# Altium schematic sheet 18-Led7.SchDoc
size A4
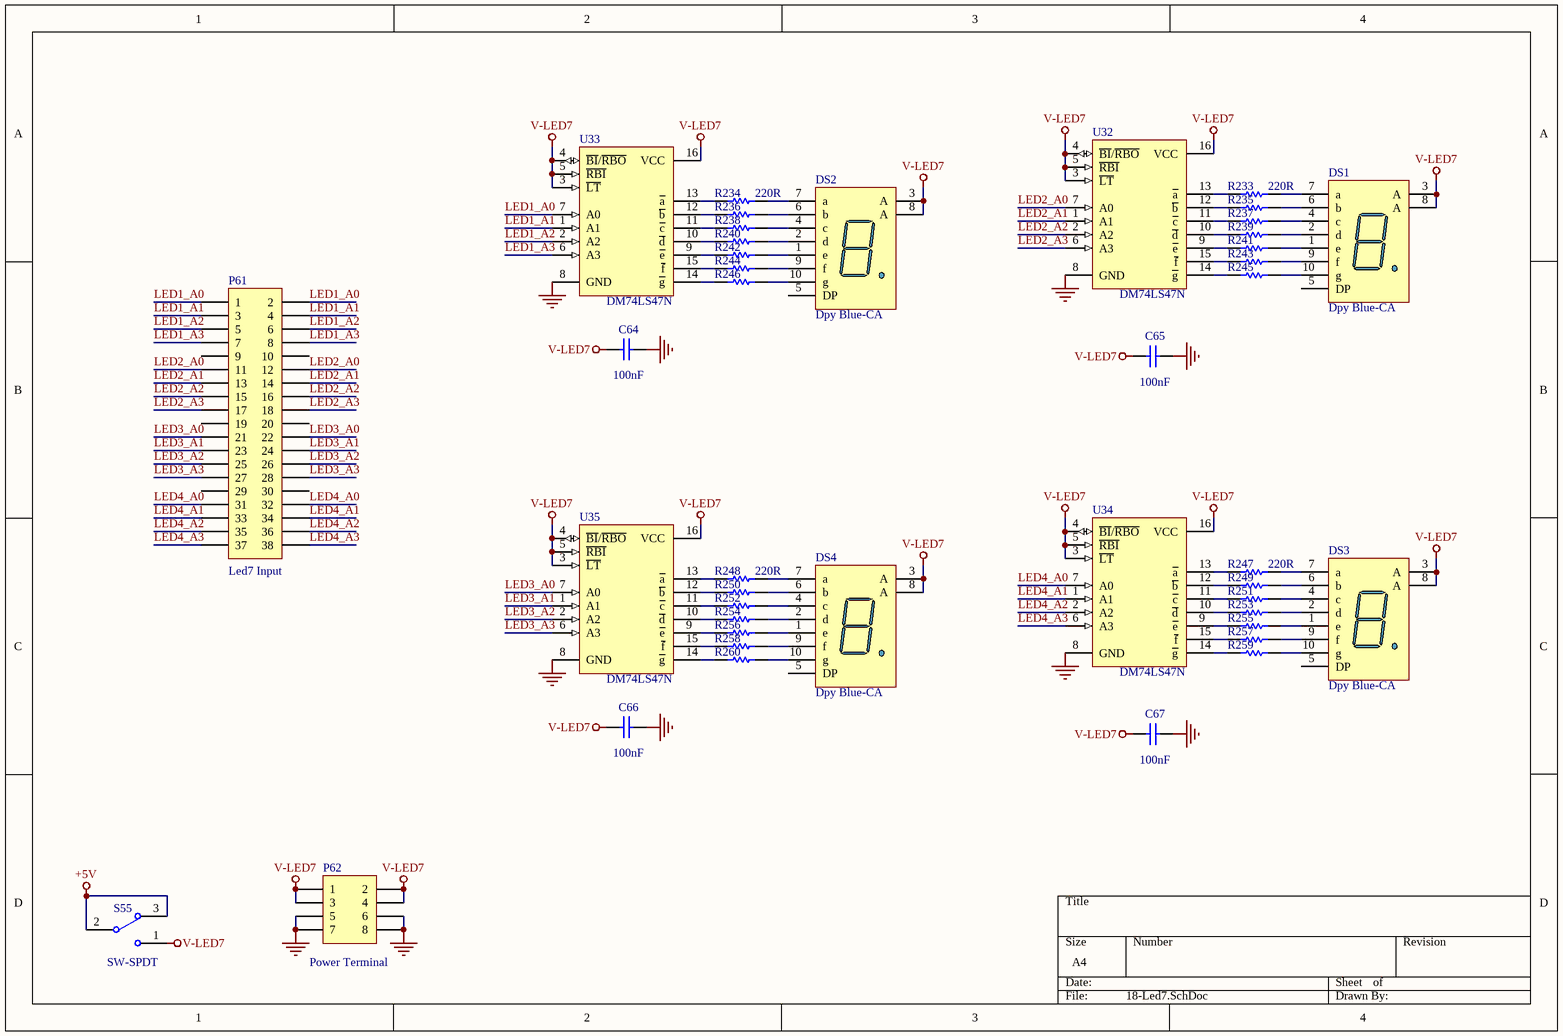
[diagram p0: 18-Led7.SchDoc]

## Parts
C64  value 100nF  [c-0805]  (hidden comment: 104)
C65  value 100nF  [c-0805]  (hidden comment: 104)
C66  value 100nF  [c-0805]  (hidden comment: 104)
C67  value 100nF  [c-0805]  (hidden comment: 104)
DS1  Dpy Blue-CA  [LED7SEG-1-0.56]
DS2  Dpy Blue-CA  [LED7SEG-1-0.56]
DS3  Dpy Blue-CA  [LED7SEG-1-0.56]
DS4  Dpy Blue-CA  [LED7SEG-1-0.56]
P61  value Led7 Input  [HDR2X19]  (hidden comment: Header 19X2)
P62  Publisher: Power Terminal  [HDR2X4]  (hidden comment: Header 4X2)
R233  220R  [r-0805]
R234  220R  [r-0805]
R235  220R  [r-0805]  (value not drawn)
R236  220R  [r-0805]  (value not drawn)
R237  220R  [r-0805]  (value not drawn)
R238  220R  [r-0805]  (value not drawn)
R239  220R  [r-0805]  (value not drawn)
R240  220R  [r-0805]  (value not drawn)
R241  220R  [r-0805]  (value not drawn)
R242  220R  [r-0805]  (value not drawn)
R243  220R  [r-0805]  (value not drawn)
R244  220R  [r-0805]  (value not drawn)
R245  220R  [r-0805]  (value not drawn)
R246  220R  [r-0805]  (value not drawn)
R247  220R  [r-0805]
R248  220R  [r-0805]
R249  220R  [r-0805]  (value not drawn)
R250  220R  [r-0805]  (value not drawn)
R251  220R  [r-0805]  (value not drawn)
R252  220R  [r-0805]  (value not drawn)
R253  220R  [r-0805]  (value not drawn)
R254  220R  [r-0805]  (value not drawn)
R255  220R  [r-0805]  (value not drawn)
R256  220R  [r-0805]  (value not drawn)
R257  220R  [r-0805]  (value not drawn)
R258  220R  [r-0805]  (value not drawn)
R259  220R  [r-0805]  (value not drawn)
R260  220R  [r-0805]  (value not drawn)
S55  SW-SPDT  [sW-DIP1SMD]
U32  DM74LS47N  [DIP16/W0.3]
U33  DM74LS47N  [DIP16/W0.3]
U34  DM74LS47N  [DIP16/W0.3]
U35  DM74LS47N  [DIP16/W0.3]

## Nets
+5V: S55.2 S55.3
GND: C64.2 C65.2 C66.2 C67.2 P62.5 P62.6 P62.7 P62.8 U32.8(GND) U33.8(GND) U34.8(GND) U35.8(GND)
V-LED7: C64.1 C65.1 C66.1 C67.1 DS1.3(A) DS1.8(A) DS2.3(A) DS2.8(A) DS3.3(A) DS3.8(A) DS4.3(A) DS4.8(A) P62.1 P62.2 P62.3 P62.4 S55.1 U32.3(~{LT}) U32.4(~{BI}/~{RBO}) U32.5(~{RBI}) U32.16(VCC) U33.3(~{LT}) U33.4(~{BI}/~{RBO}) U33.5(~{RBI}) U33.16(VCC) U34.3(~{LT}) U34.4(~{BI}/~{RBO}) U34.5(~{RBI}) U34.16(VCC) U35.3(~{LT}) U35.4(~{BI}/~{RBO}) U35.5(~{RBI}) U35.16(VCC)
LED1_A0: P61.1 P61.2 U33.7(A0)
LED1_A1: P61.3 P61.4 U33.1(A1)
LED1_A2: P61.5 P61.6 U33.2(A2)
LED1_A3: P61.7 P61.8 U33.6(A3)
LED2_A0: P61.11 P61.12 U32.7(A0)
LED2_A1: P61.13 P61.14 U32.1(A1)
LED2_A2: P61.15 P61.16 U32.2(A2)
LED2_A3: P61.17 P61.18 U32.6(A3)
LED3_A0: P61.21 P61.22 U35.7(A0)
LED3_A1: P61.23 P61.24 U35.1(A1)
LED3_A2: P61.25 P61.26 U35.2(A2)
LED3_A3: P61.27 P61.28 U35.6(A3)
LED4_A0: P61.31 P61.32 U34.7(A0)
LED4_A1: P61.33 P61.34 U34.1(A1)
LED4_A2: P61.35 P61.36 U34.2(A2)
LED4_A3: P61.37 P61.38 U34.6(A3)
NetDS1_1: DS1.1(e) R241.2
NetDS1_2: DS1.2(d) R239.2
NetDS1_4: DS1.4(c) R237.2
NetDS1_6: DS1.6(b) R235.2
NetDS1_7: DS1.7(a) R233.2
NetDS1_9: DS1.9(f) R243.2
NetDS1_10: DS1.10(g) R245.2
NetDS2_1: DS2.1(e) R242.2
NetDS2_2: DS2.2(d) R240.2
NetDS2_4: DS2.4(c) R238.2
NetDS2_6: DS2.6(b) R236.2
NetDS2_7: DS2.7(a) R234.2
NetDS2_9: DS2.9(f) R244.2
NetDS2_10: DS2.10(g) R246.2
NetDS3_1: DS3.1(e) R255.2
NetDS3_2: DS3.2(d) R253.2
NetDS3_4: DS3.4(c) R251.2
NetDS3_6: DS3.6(b) R249.2
NetDS3_7: DS3.7(a) R247.2
NetDS3_9: DS3.9(f) R257.2
NetDS3_10: DS3.10(g) R259.2
NetDS4_1: DS4.1(e) R256.2
NetDS4_2: DS4.2(d) R254.2
NetDS4_4: DS4.4(c) R252.2
NetDS4_6: DS4.6(b) R250.2
NetDS4_7: DS4.7(a) R248.2
NetDS4_9: DS4.9(f) R258.2
NetDS4_10: DS4.10(g) R260.2
NetR233_1: R233.1 U32.13(~{a})
NetR234_1: R234.1 U33.13(~{a})
NetR235_1: R235.1 U32.12(~{b})
NetR236_1: R236.1 U33.12(~{b})
NetR237_1: R237.1 U32.11(~{c})
NetR238_1: R238.1 U33.11(~{c})
NetR239_1: R239.1 U32.10(~{d})
NetR240_1: R240.1 U33.10(~{d})
NetR241_1: R241.1 U32.9(~{e})
NetR242_1: R242.1 U33.9(~{e})
NetR243_1: R243.1 U32.15(~{f})
NetR244_1: R244.1 U33.15(~{f})
NetR245_1: R245.1 U32.14(~{g})
NetR246_1: R246.1 U33.14(~{g})
NetR247_1: R247.1 U34.13(~{a})
NetR248_1: R248.1 U35.13(~{a})
NetR249_1: R249.1 U34.12(~{b})
NetR250_1: R250.1 U35.12(~{b})
NetR251_1: R251.1 U34.11(~{c})
NetR252_1: R252.1 U35.11(~{c})
NetR253_1: R253.1 U34.10(~{d})
NetR254_1: R254.1 U35.10(~{d})
NetR255_1: R255.1 U34.9(~{e})
NetR256_1: R256.1 U35.9(~{e})
NetR257_1: R257.1 U34.15(~{f})
NetR258_1: R258.1 U35.15(~{f})
NetR259_1: R259.1 U34.14(~{g})
NetR260_1: R260.1 U35.14(~{g})

Not connected (* = marked no-connect by the designer): DS1 5(DP); DS2 5(DP); DS3 5(DP); DS4 5(DP); P61 9 10 19 20 29 30

## Library data of the parts
C64-C67 = Cap: Capacitor; Published: 8-Jun-2000; LatestRevisionDate: 17-Jul-2002; LatestRevisionNote: Re-released for DXP Platform.; PackageReference: RAD-0.3; Publisher: Altium Limited; PackageDescription: Radial Cap, Thru-Hole; 2 Leads; 0.3 in Pin Spacing
DS1-DS4 = Dpy Blue-CA: 14.2 mm General Purpose Blue 7-Segment Display: CA, RH DP, Gray Surface; MinimumIntensity: 2020 ucd; Note: IF = 10 mA; Published: 8-Jun-2000; LatestRevisionDate: 17-Dec-2003; LatestRevisionNote: Schematic revised, PCB Footprint replaced.; DatasheetVersion: 24-Sep-2002; PackageVersion: 24-Sep-2002; PackageReference: H; Publisher: Altium Limited; PackageDescription: LED, 7-Segment Display, 14.2 mm, RHD; 10 Leads; Row Space 15.24 mm; Pitch 2.54 mm; Colour: Blue; ComponentLink1Description: Manufacturer Link; ComponentLink1URL: http://www.agilent.com/
P61 = Header 19X2: Header, 19-Pin, Dual row; LatestRevisionDate: 17-Jul-2002; LatestRevisionNote: Re-released for DXP Platform.
P62 = Header 4X2: Header, 4-Pin, Dual row; LatestRevisionDate: 17-Jul-2002; LatestRevisionNote: Re-released for DXP Platform.
R233-R260 = Res1: Resistor; Published: 8-Jun-2000; LatestRevisionDate: 17-Jul-2002; LatestRevisionNote: Re-released for DXP Platform.; PackageReference: AXIAL-0.3; Publisher: Altium Limited; PackageDescription: Axial Device, Thru-Hole; 2 Leads; 0.3 in Pin Spacing; Value: 220R
S55 = SW-SPDT: SPDT Subminiature Toggle Switch, Right Angle Mounting, Vertical Actuation; Published: 24-Mar-1999; LatestRevisionDate: 17-Dec-2003; LatestRevisionNote: Schematic revised, PCB Footprint replaced.; DatasheetVersion: 05-Dec-2000; PackageReference: TL36WW15050; Publisher: Altium Limited; PackageDescription: Switch; 4 Leads; ComponentLink1Description: Manufacturer Link; ComponentLink1URL: http://www.apem.com
U32-U35 = DM74LS47N: BCD to 7-Segment Decoder/Driver with Open-Collector Output; Published: 17-Jul-2002; LatestRevisionDate: 04-Mar-2005; LatestRevisionNote: Stylized 3D Model Added.; DatasheetVersion: Mar-1998; PackageVersion: 2000; PackageReference: N16E; Publisher: Altium Limited; PackageDescription: DIP, 16-Pin, Row Spacing 7.62 mm, Pitch 2.54 mm; ComponentLink1Description: Manufacturer Link; ComponentLink1URL: http://www.fairchildsemi.com/